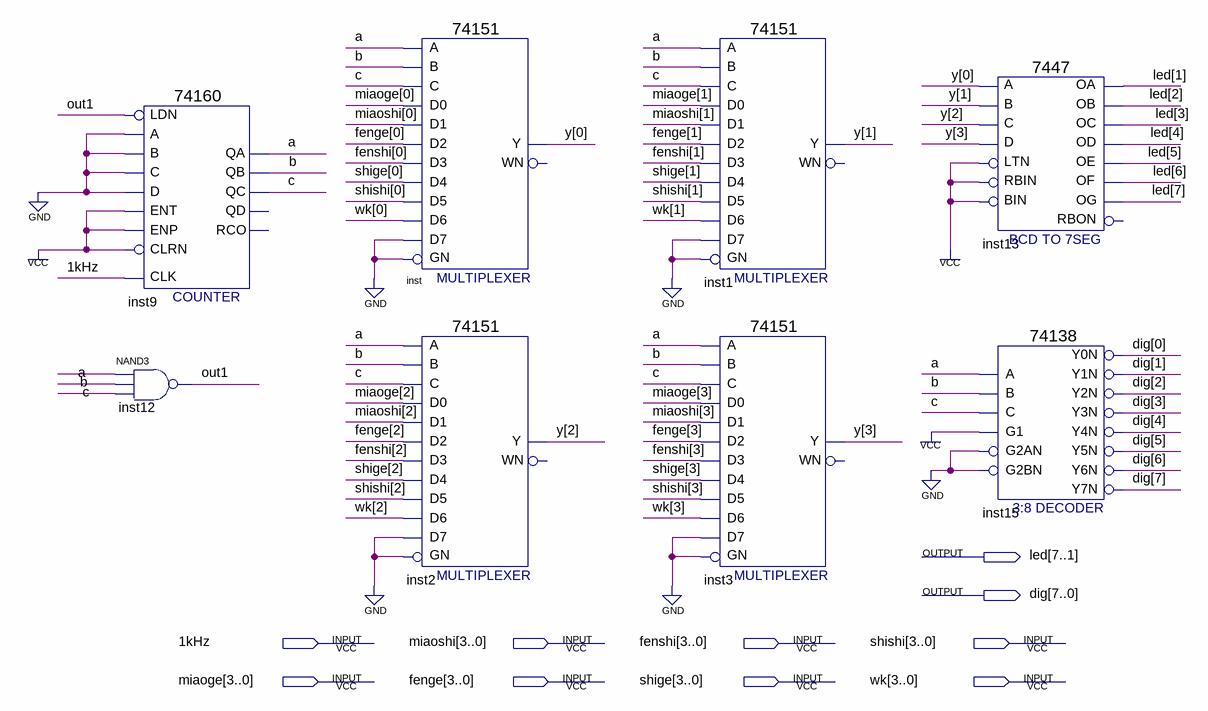
[diagram p0: schematic sheet]
// Quartus schematic display.bdf as structural Verilog: 8 symbols, 10 pins
module display (
  input  \1kHz ,
  input  [3:0] miaoshi,
  input  [3:0] fenshi,
  input  [3:0] shishi,
  input  [3:0] miaoge,
  input  [3:0] fenge,
  input  [3:0] shige,
  input  [3:0] wk,
  output [7:1] led,
  output [7:0] dig
);

  wire a, b, c, out1;
  wire [3:0] y;

  nand inst12 (out1, a, b, c);
  \74160  inst9 (
    .CLK(\1kHz ), .ENT(1'b1), .A(1'b0), .B(1'b0), .C(1'b0), .D(1'b0), .LDN(out1), .ENP(1'b1), .CLRN(1'b1),
    .QA(a), .QB(b), .QC(c));  // open: QD, RCO
  \74151  inst (
    .GN(1'b0), .C(c), .B(b), .A(a), .D5(shishi[0]), .D0(miaoge[0]), .D1(miaoshi[0]), .D4(shige[0]),
    .D3(fenshi[0]), .D2(fenge[0]), .D6(wk[0]), .D7(1'b0), .Y(y[0]));  // open: WN
  \74151  inst2 (
    .GN(1'b0), .C(c), .B(b), .A(a), .D5(shishi[2]), .D0(miaoge[2]), .D1(miaoshi[2]), .D4(shige[2]),
    .D3(fenshi[2]), .D2(fenge[2]), .D6(wk[2]), .D7(1'b0), .Y(y[2]));  // open: WN
  \74151  inst1 (
    .GN(1'b0), .C(c), .B(b), .A(a), .D5(shishi[1]), .D0(miaoge[1]), .D1(miaoshi[1]), .D4(shige[1]),
    .D3(fenshi[1]), .D2(fenge[1]), .D6(wk[1]), .D7(1'b0), .Y(y[1]));  // open: WN
  \74151  inst3 (
    .GN(1'b0), .C(c), .B(b), .A(a), .D5(shishi[3]), .D0(miaoge[3]), .D1(miaoshi[3]), .D4(shige[3]),
    .D3(fenshi[3]), .D2(fenge[3]), .D6(wk[3]), .D7(1'b0), .Y(y[3]));  // open: WN
  \7447  inst13 (
    .LTN(1'b1), .B(y[1]), .C(y[2]), .D(y[3]), .RBIN(1'b1), .BIN(1'b1), .A(y[0]), .OB(led[2]), .OC(led[3]),
    .OE(led[5]), .OD(led[4]), .OF(led[6]), .OG(led[7]), .OA(led[1]));  // open: RBON
  \74138  inst15 (
    .A(a), .B(b), .G1(1'b1), .C(c), .G2AN(1'b0), .G2BN(1'b0), .Y0N(dig[0]), .Y1N(dig[1]), .Y2N(dig[2]),
    .Y3N(dig[3]), .Y4N(dig[4]), .Y5N(dig[5]), .Y6N(dig[6]), .Y7N(dig[7]));
endmodule
